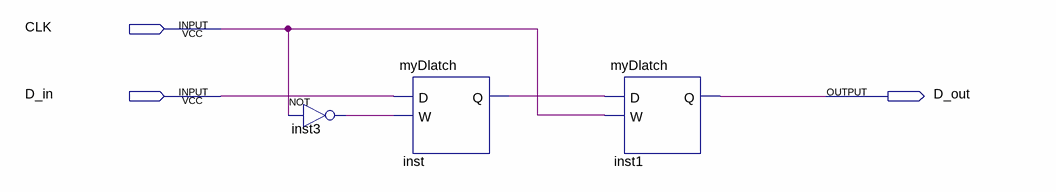
[diagram p0: schematic sheet]
// Quartus schematic myDflipflop.bdf as structural Verilog: 3 symbols, 3 pins
module myDflipflop (
  input  CLK,
  input  D_in,
  output D_out
);

  wire inst3_out, inst_q;

  not inst3 (inst3_out, CLK);
  myDlatch inst (.D(D_in), .W(inst3_out), .Q(inst_q));
  myDlatch inst1 (.D(inst_q), .W(CLK), .Q(D_out));
endmodule
